# Altium schematic sheet USB-C.SchDoc
size A4; SheetNumber: 3; SheetTotal: 4
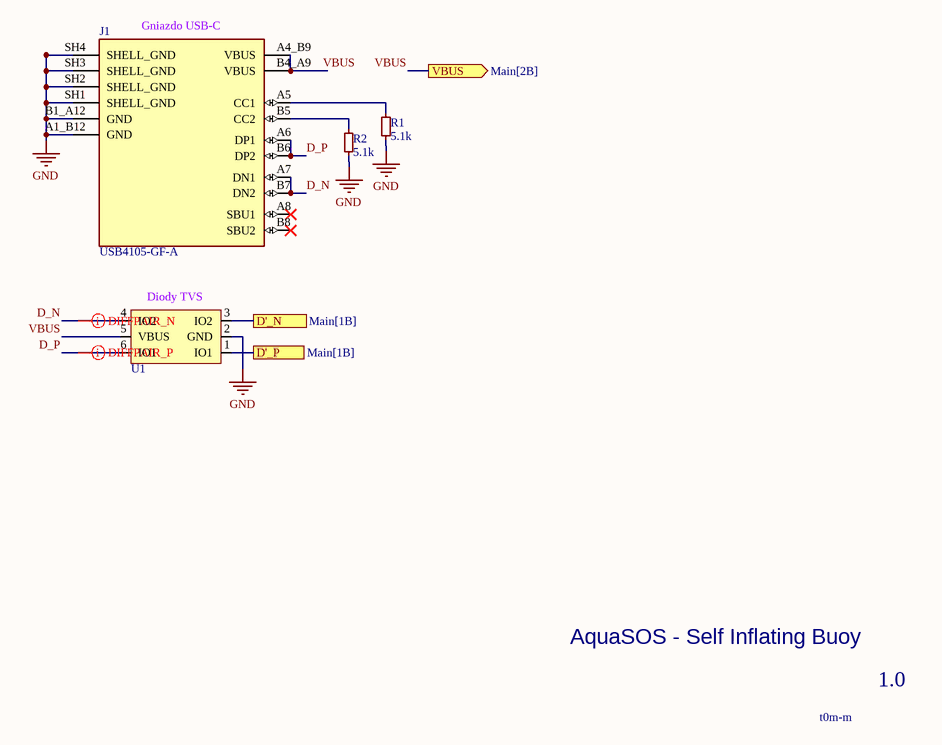
[diagram p0: USB-C.SchDoc]

## Parts
J1  USB4105-GF-A  [GCT_USB4105-GF-A]
R1  5.1k  [RC0402JR-075K1P]
R2  5.1k  [RC0402JR-075K1P]
U1  USBLC6-2SC6  [USBLC6-2SC6]  (value not drawn)

## Ports
D'_N (see Main[1B]), D'_P (see Main[1B]), VBUS (out, see Main[2B])

## Nets
GND: J1.A1_B12(GND) J1.B1_A12(GND) J1.SH1(SHELL_GND) J1.SH2(SHELL_GND) J1.SH3(SHELL_GND) J1.SH4(SHELL_GND) R1.2 R2.2 U1.2(GND)
D'_N: U1.3(IO2) ; port D'_N
D'_P: U1.1(IO1) ; port D'_P
D_N: J1.A7(DN1) J1.B7(DN2) U1.4(IO2)
D_P: J1.A6(DP1) J1.B6(DP2) U1.6(IO1)
VBUS: J1.A4_B9(VBUS) J1.B4_A9(VBUS) U1.5(VBUS) ; port VBUS
NetJ1_A5: J1.A5(CC1) R1.1
NetJ1_B5: J1.B5(CC2) R2.1

Not connected (* = marked no-connect by the designer): J1 A8(SBU1)* B8(SBU2)*

## Layout directives
differential pair: D_N, D_P

## Notes on the sheet
- (near J1) Gniazdo USB-C
- (near U1) Diody TVS
- AquaSOS - Self Inflating Buoy
- 1.0
- t0m-m

## Library data of the parts
J1 = USB4105-GF-A: USB-C Connector, USB 2.0; MF: {'manufacturer': u'GCT'}; Package: None; Price: None; Value: *; MP: USB4105-GF-A; Availability: Unavailable
R1 R2 = RC0402JR-075K1P: 5.1k resistor; ComponentLink1Description: Mouser link; ComponentLink1URL: https://www.mouser.pl/ProductDetail/YAGEO/RC0402JR-075K1P?qs=qpJ%252B%252B%252Bdg6p1LG47uFSJoBw%3D%3D
U1 = USBLC6-2SC6: ESD/TVS Diodes; ComponentLink1Description: Mouser Link; ComponentLink1URL: https://www.mouser.pl/ProductDetail/STMicroelectronics/USBLC6-2SC6?qs=po45yt2pPpu%2FhNIlwQdTlg%3D%3D&utm_id=9882661914&utm_source=google&utm_medium=cpc&utm_marketing_tactic=emeacorp&gad_source=1&gad_campaignid=9882661914&gbraid=0AAAAADn_wf3e2b9L6UzwCvd5llWdJDX32&gclid=CjwKCAiAtLvMBhB_EiwA1u6_PphI6vqALNJyH9qzLX2TgkqKXihyqulPr-2MUC0dCpD_RqMgLp4OABoC-lQQAvD_BwE